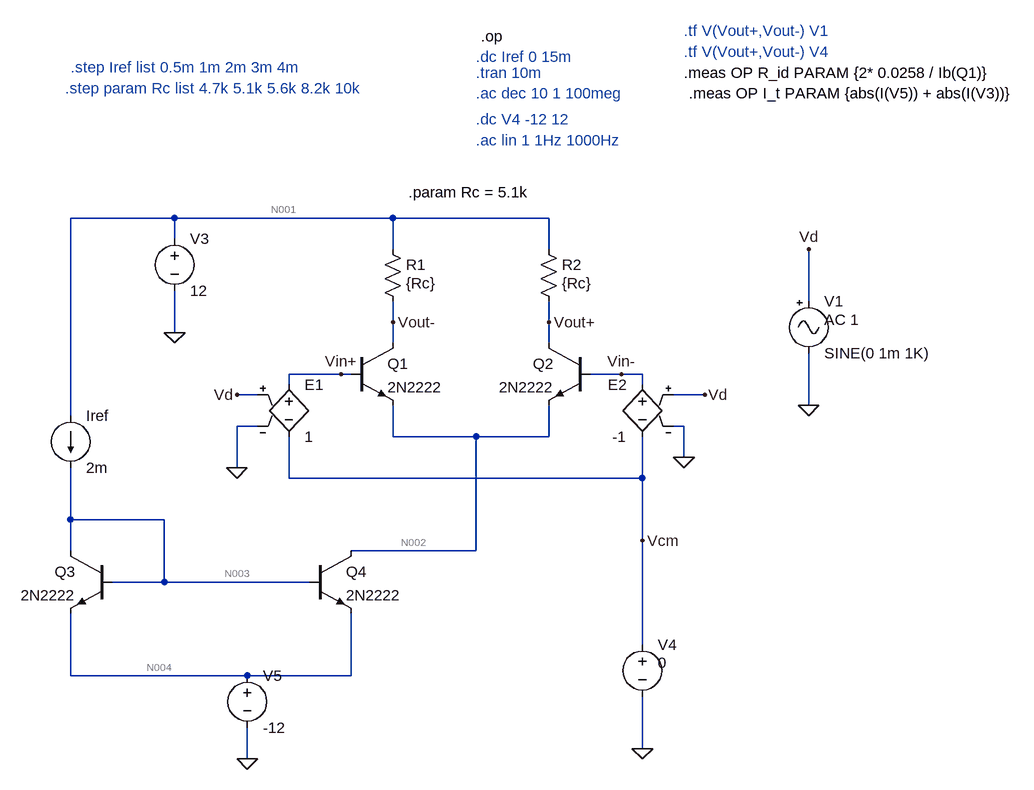
[diagram p0: schematic DiffAmp-Resload.asc]
DiffAmp-Resload.asc, the LTspice schematic file:
Version 4.1
SHEET 1 1636 680
WIRE 96 -416 -64 -416
WIRE 432 -416 96 -416
WIRE 672 -416 432 -416
WIRE 96 -384 96 -416
WIRE 432 -368 432 -416
WIRE 672 -368 672 -416
WIRE 1072 -288 1072 -368
WIRE 432 -256 432 -288
WIRE 672 -256 672 -288
WIRE 96 -240 96 -304
WIRE 432 -224 432 -256
WIRE 672 -224 672 -256
WIRE 352 -176 272 -176
WIRE 368 -176 352 -176
WIRE 784 -176 736 -176
WIRE 816 -176 784 -176
WIRE 272 -160 272 -176
WIRE 816 -160 816 -176
WIRE 224 -144 192 -144
WIRE 912 -144 864 -144
WIRE 1072 -128 1072 -208
WIRE -64 -112 -64 -416
WIRE 224 -96 192 -96
WIRE 880 -96 864 -96
WIRE 432 -80 432 -128
WIRE 560 -80 432 -80
WIRE 672 -80 672 -128
WIRE 672 -80 560 -80
WIRE 880 -48 880 -96
WIRE 192 -32 192 -96
WIRE 272 -16 272 -80
WIRE 816 -16 816 -80
WIRE 816 -16 272 -16
WIRE -64 48 -64 -32
WIRE 80 48 -64 48
WIRE 816 80 816 -16
WIRE -64 96 -64 48
WIRE 560 96 560 -80
WIRE 560 96 368 96
WIRE 80 144 80 48
WIRE 80 144 0 144
WIRE 304 144 80 144
WIRE 816 240 816 80
WIRE -64 288 -64 192
WIRE 208 288 -64 288
WIRE 368 288 368 192
WIRE 368 288 208 288
WIRE 816 400 816 320
WIRE 208 416 208 368
FLAG 816 400 0
FLAG 96 -240 0
FLAG 208 416 0
FLAG 816 80 Vcm
FLAG 432 -256 Vout-
FLAG 672 -256 Vout+
FLAG 1072 -368 Vd
FLAG 1072 -128 0
FLAG 912 -144 Vd
FLAG 192 -144 Vd
FLAG 192 -32 0
FLAG 880 -48 0
FLAG 352 -176 Vin+
FLAG 784 -176 Vin-
SYMBOL npn 304 96 R0
SYMATTR InstName Q4
SYMATTR Value 2N2222
SYMBOL npn 0 96 M0
SYMATTR InstName Q3
SYMATTR Value 2N2222
SYMBOL npn 736 -224 M0
SYMATTR InstName Q2
SYMATTR Value 2N2222
SYMBOL npn 368 -224 R0
SYMATTR InstName Q1
SYMATTR Value 2N2222
SYMBOL res 416 -384 R0
WINDOW 3 36 68 Left 2
SYMATTR InstName R1
SYMATTR Value {Rc}
SYMBOL res 656 -384 R0
WINDOW 3 36 68 Left 2
SYMATTR InstName R2
SYMATTR Value {Rc}
SYMBOL voltage 96 -400 R0
SYMATTR InstName V3
SYMATTR Value 12
SYMBOL voltage 816 224 R0
WINDOW 3 24 44 Left 2
WINDOW 123 0 0 Left 0
WINDOW 39 0 0 Left 0
SYMATTR InstName V4
SYMATTR Value 0
SYMBOL current -64 -112 R0
WINDOW 123 0 0 Left 0
WINDOW 39 0 0 Left 0
SYMATTR InstName Iref
SYMATTR Value 2m
SYMBOL voltage 208 272 R0
WINDOW 123 0 0 Left 0
WINDOW 39 0 0 Left 0
SYMATTR InstName V5
SYMATTR Value -12
SYMBOL e 272 -176 R0
SYMATTR InstName E1
SYMATTR Value 1
SYMBOL e 816 -176 M0
SYMATTR InstName E2
SYMATTR Value -1
SYMBOL Misc\\signal 1072 -304 R0
WINDOW 123 24 44 Left 2
WINDOW 39 0 0 Left 0
SYMATTR InstName V1
SYMATTR Value SINE(0 1m 1K)
SYMATTR Value2 AC 1
TEXT 560 -608 Left 2 ;.ac dec 10 1 100meg
TEXT 560 -664 Left 2 ;.dc Iref 0 15m
TEXT 560 -640 Left 2 ;.tran 10m
TEXT -64 -648 Left 2 ;.step Iref list 0.5m 1m 2m 3m 4m
TEXT 880 -672 Left 2 ;.tf V(Vout+,Vout-) V4
TEXT -72 -616 Left 2 ;.step param Rc list 4.7k 5.1k 5.6k 8.2k 10k
TEXT 560 -568 Left 2 ;.dc V4 -12 12
TEXT 456 -456 Left 2 !.param Rc = 5.1k
TEXT 560 -536 Left 2 ;.ac lin 1 1Hz 1000Hz
TEXT 568 -696 Left 2 !.op
TEXT 880 -640 Left 2 !.meas OP R_id PARAM {2* 0.0258 / Ib(Q1)}
TEXT 880 -704 Left 2 ;.tf V(Vout+,Vout-) V1
TEXT 888 -608 Left 2 !.meas OP I_t PARAM {abs(I(V5)) + abs(I(V3))}

The netlist it stands for:
* DiffAmp-Resload.asc
Q4 N002 N003 N004 0 2N2222
Q3 N003 N003 N004 0 2N2222
Q2 Vout+ Vin- N002 0 2N2222
Q1 Vout- Vin+ N002 0 2N2222
R1 N001 Vout- {Rc}
R2 N001 Vout+ {Rc}
V3 N001 0 12
V4 Vcm 0 0
Iref N001 N003 2m
V5 N004 0 -12
E1 Vin+ Vcm Vd 0 1
E2 Vin- Vcm Vd 0 -1
V1 Vd 0 SINE(0 1m 1K) AC 1
.model NPN NPN
.model PNP PNP
.lib standard.bjt
* .ac dec 10 1 100meg
* .dc Iref 0 15m
* .tran 10m
* .step Iref list 0.5m 1m 2m 3m 4m
* .tf V(Vout+,Vout-) V4
* .step param Rc list 4.7k 5.1k 5.6k 8.2k 10k
* .dc V4 -12 12
.param Rc = 5.1k
* .ac lin 1 1Hz 1000Hz
.op
.meas OP R_id PARAM {2* 0.0258 / Ib(Q1)}
* .tf V(Vout+,Vout-) V1
.meas OP I_t PARAM {abs(I(V5)) + abs(I(V3))}
.backanno
.end

* Results of the author's LTspice run, read from the files saved beside the schematic
* Operating Point:
*   V(n003) = -11.33 V
*   V(vout+) = 6.447 V
*   V(vin-) = 0 V
*   V(vin+) = 0 V
*   V(vd) = 0 V
*   V(n002) = -656.1 mV
*   V(n004) = -12 V
*   V(vout-) = 6.447 V
*   V(n001) = 12 V
*   V(vcm) = 0 V
*   Ic(Q2) = 1.089 mA
*   Ib(Q2) = 5.132 µA
*   Ie(Q2) = -1.094 mA
*   Is(Q2) = 0 A
*   I(R2) = 1.089 mA
*   I(E1) = -5.132 µA
*   I(V1) = 0 A
*   Ic(Q4) = 2.188 mA
*   Ib(Q4) = 9.95 µA
*   Ie(Q4) = -2.198 mA
*   Is(Q4) = 0 A
*   I(R1) = 1.089 mA
*   I(V4) = -10.26 µA
*   Ic(Q1) = 1.089 mA
*   Ib(Q1) = 5.132 µA
*   Ie(Q1) = -1.094 mA
*   Is(Q1) = 0 A
*   I(Iref) = 2 mA
*   I(V5) = 4.188 mA
*   Ic(Q3) = 1.98 mA
*   Ib(Q3) = 9.966 µA
*   Ie(Q3) = -1.99 mA
*   Is(Q3) = 0 A
*   I(V3) = -4.178 mA
*   I(E2) = -5.132 µA